# EAGLE design rapidshark-lipo-sensor-mk-2.1 (EAGLE 6.5.0)
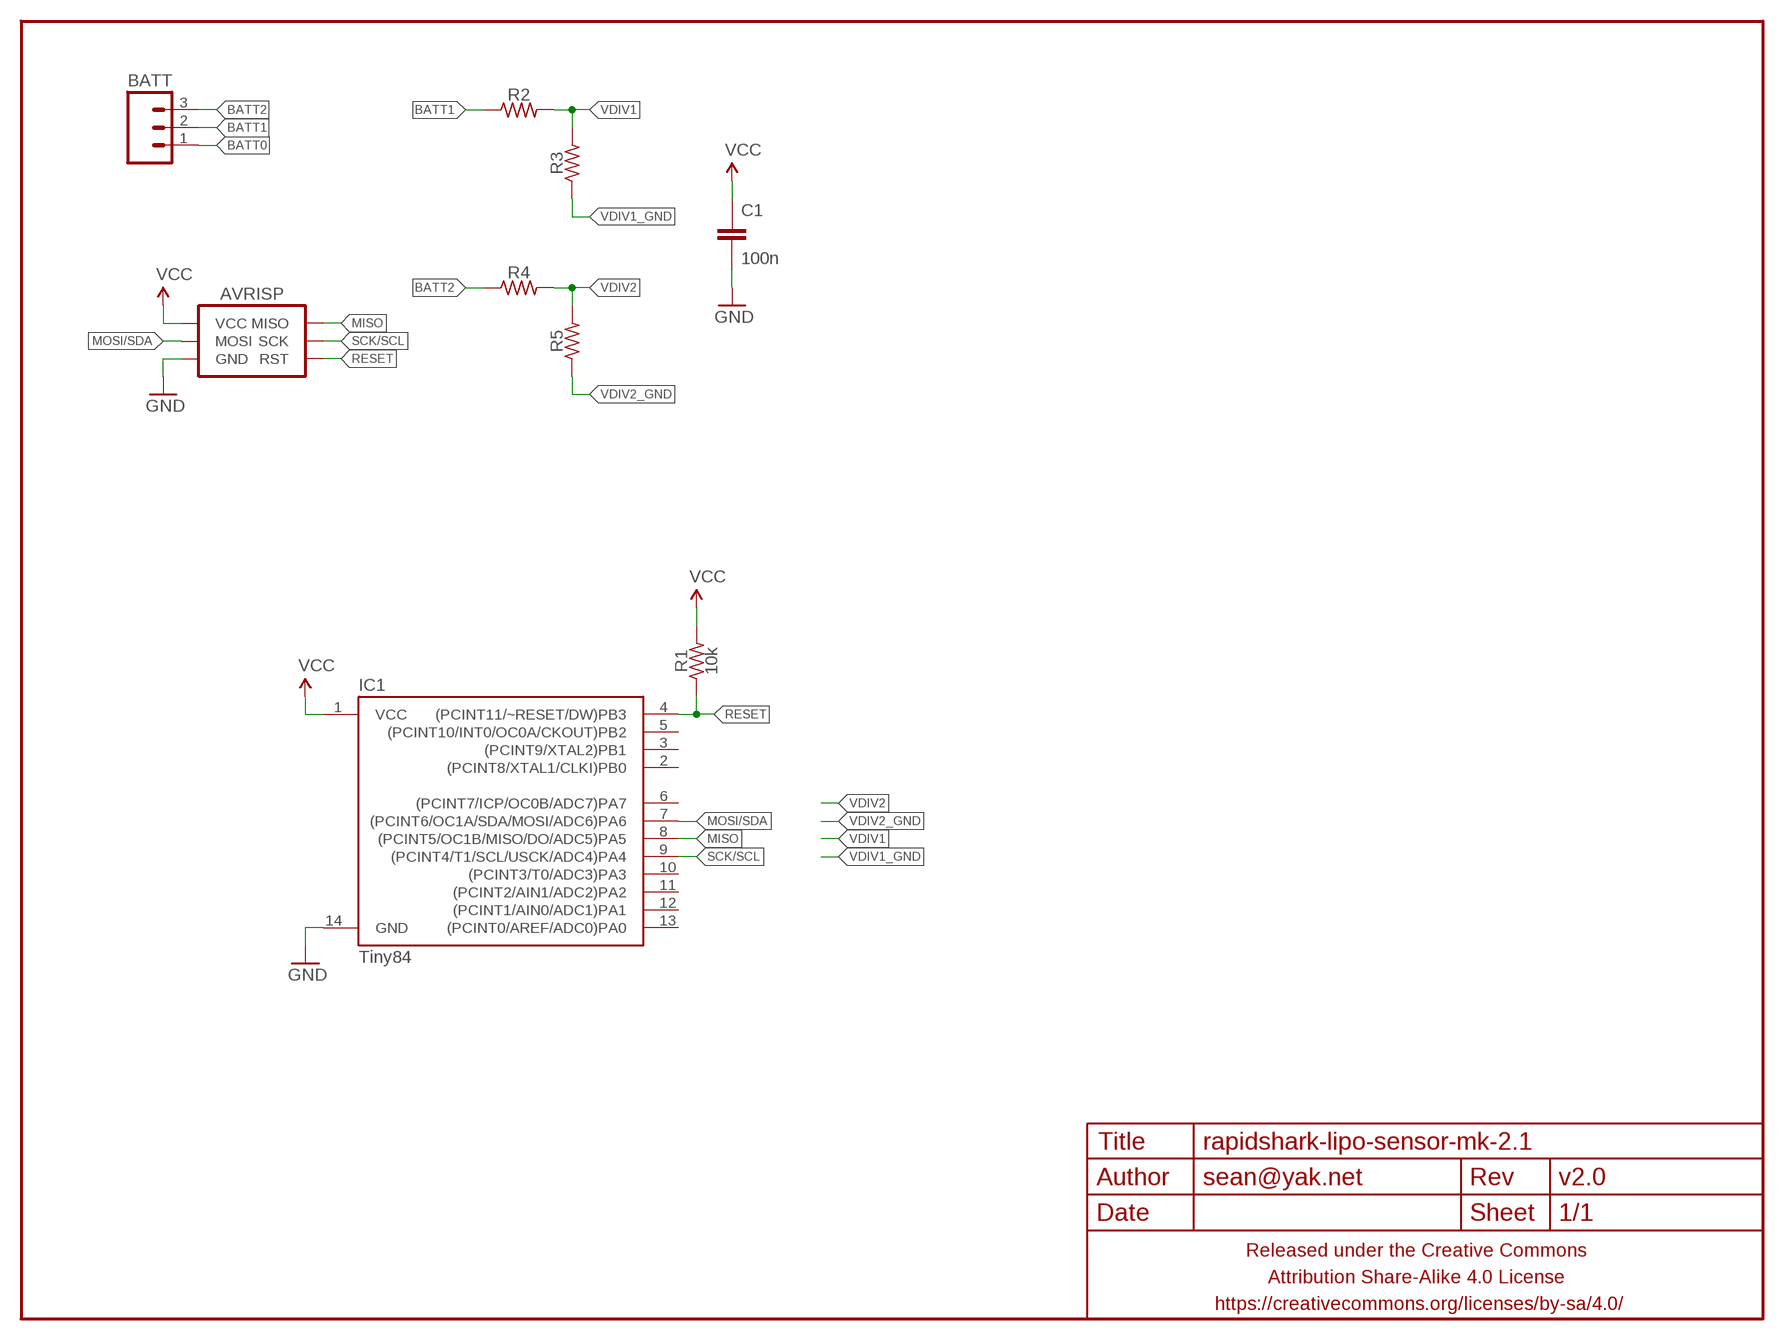
[diagram p0: schematic, sheet 1]

## Parts
AVRISP  AVR_SPI_PRG_6PTH_INLINE_I2C  [AVR_ISP_INLINE_PTH_I2C]
BATT  M03PTH-CENTERED  [1X03-CENTERED]
C1  100n  CAPACITOR-CERAMIC025-024X044  [C025-024X044]
FRAME1  FRAME-LETTERNO_PACKAGE  [DUMMY]
IC1  Tiny84  ATTINY84ATTINY84-20PU  [DIL14]
R1  10k  RESISTORPTH-AXIAL-5.08MM  [RESISTOR-AXIAL-PTH-5.08MM]
R2  RESISTORPTH-AXIAL-5.08MM  [RESISTOR-AXIAL-PTH-5.08MM]
R3  RESISTORPTH-AXIAL-5.08MM  [RESISTOR-AXIAL-PTH-5.08MM]
R4  RESISTORPTH-AXIAL-5.08MM  [RESISTOR-AXIAL-PTH-5.08MM]
R5  RESISTORPTH-AXIAL-5.08MM  [RESISTOR-AXIAL-PTH-5.08MM]

## Nets
BATT0: BATT.1
BATT1: BATT.2 R2.P$1
BATT2: BATT.3 R4.P$1
GND: AVRISP.GND C1.2 IC1.14(GND)
MISO: AVRISP.MISO IC1.8((PCINT5/OC1B/MISO/DO/ADC5)PA5)
MOSI/SDA: AVRISP.MOSI IC1.7((PCINT6/OC1A/SDA/MOSI/ADC6)PA6)
RESET: AVRISP.RESET(RST) IC1.4((PCINT11/~RESET/DW)PB3) R1.P$1
SCK/SCL: AVRISP.SCK IC1.9((PCINT4/T1/SCL/USCK/ADC4)PA4)
VCC: AVRISP.VCC C1.1 IC1.1(VCC) R1.P$2
VDIV1: R2.P$2 R3.P$2
VDIV1_GND: R3.P$1
VDIV2: R4.P$2 R5.P$2
VDIV2_GND: R5.P$1
Unconnected: IC1.2((PCINT8/XTAL1/CLKI)PB0) IC1.3((PCINT9/XTAL2)PB1) IC1.5((PCINT10/INT0/OC0A/CKOUT)PB2) IC1.6((PCINT7/ICP/OC0B/ADC7)PA7) IC1.10((PCINT3/T0/ADC3)PA3) IC1.11((PCINT2/AIN1/ADC2)PA2) IC1.12((PCINT1/AIN0/ADC1)PA1) IC1.13((PCINT0/AREF/ADC0)PA0)

## Library data of the parts
AVRISP = A_butts:AVR_SPI_PRG_6: AVR ISP 6 Pin This is the reduced ISP connector for AVR programming. Common on Arduino. This footprint will take up less PCB space and can be used with a 10-pin to 6-pin adapter such as SKU: BOB-08508 **Special note about "TEST_POINT" package. The stop mask is on the top side, so if you want your programming test points to be on the bottom of your board, make sure to place this package on the bottom side of the board. This also ensure that the orientation to program from the bottom side will be correct.
BATT = A_butts:M03: Header 3 Standard 3-pin 0.1" header. Use with straight break away headers (SKU : PRT-00116), right angle break away headers (PRT-00553), swiss pins (PRT-00743), machine pins (PRT-00117), and female headers (PRT-00115). Molex polarized connector foot print use with SKU : PRT-08232 with associated crimp pins and housings.
C1 = A_butts:CAPACITOR-CERAMIC: CAPACITOR, European symbol
FRAME1 = A_butts:FRAME-LETTER: Schematic Frame Standard 8.5x11 US Letter frame; DESIGNER: sean@yak.net; VERSION: v2.0
IC1 = A_butts:ATTINY84: Atmel 14-pin 2/4/8kB flash uC
R1-R5 = A_butts:RESISTOR: RESISTOR, American symbol

## Board
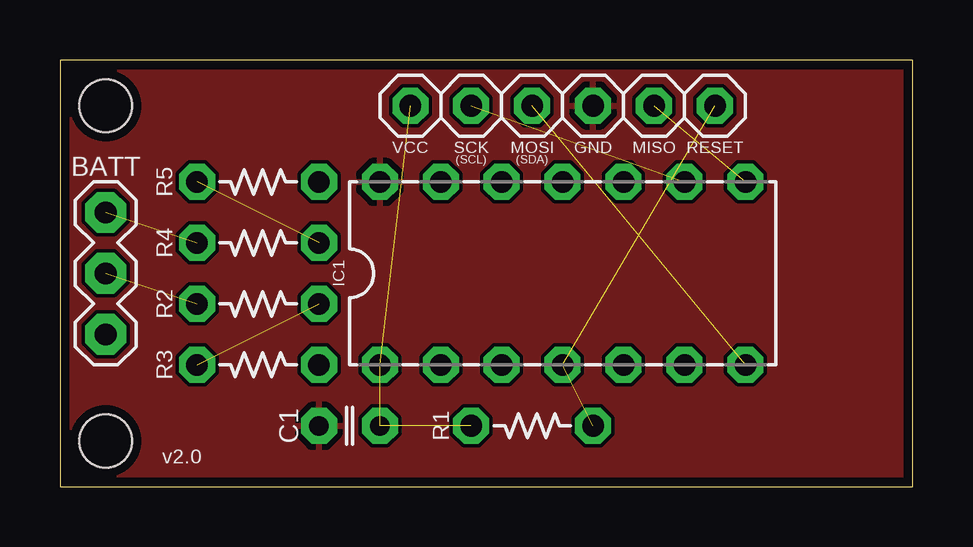
[diagram p1: board, top side]

Size 35.56 x 17.78 mm. Coordinates in mm from the lower left corner, seen from the top.
Outline: 0,17.78 0,0 35.56,0 35.56,17.78 0,17.78
Copper layers (1*16): Top 0.0356mm / dielectric 1.5011mm / Bottom 0.0356mm
Design rules "LaenPCBOrder_2": minimum track width 6mil, minimum drill 13mil, track to track 6mil, track to pad 6mil, pad to pad 6mil, via to via 6mil, smd to smd 6mil, copper to edge 15mil, drill to drill 6mil, minimum pad ring 7mil, minimum via ring 7mil, stop-mask expansion 3mil, vias tented up to drill 20mil, thermal gap 10mil
Holes 2.2 mm at 1.91,15.88 1.91,1.91

### Footprints (pad centres in the part's own frame; a part is rotated, then mirrored left to right if it is on the bottom)
AVR_ISP_INLINE_PTH_I2C = drill 0.9 pad 1.5 octagon: GND 1.27,0; MISO 3.81,0; MOSI -1.27,0; RESET 6.35,0; SCK -3.81,0; VCC -6.35,0
1X03-CENTERED = drill 0.9 pad 1.7 octagon: 1 -2.54,0; 2 0,0; 3 2.54,0
C025-024X044 = drill 0.813 pad 1.5 octagon: 1 -1.27,0; 2 1.27,0
DIL14 = drill 0.9 pad 1.5 octagon: 1 -7.62,-3.81; 2 -5.08,-3.81; 3 -2.54,-3.81; 4 0,-3.81; 5 2.54,-3.81; 6 5.08,-3.81; 7 7.62,-3.81; 8 7.62,3.81; 9 5.08,3.81; 10 2.54,3.81; 11 0,3.81; 12 -2.54,3.81; 13 -5.08,3.81; 14 -7.62,3.81
RESISTOR-AXIAL-PTH-5.08MM = drill 0.9 pad 1.5 octagon: P$1 -2.54,0; P$2 2.54,0

### Placement (x,y rotation side)
AVRISP  20.95,15.88 0 top
BATT  1.91,8.89 90 top
C1  12.06,2.54 180 top
FRAME1  0,0 0 top
IC1  20.95,8.89 0 top
R1  19.68,2.54 180 top
R2  8.26,7.62 0 top
R3  8.26,5.08 180 top
R4  8.26,10.16 0 top
R5  8.26,12.7 180 top

### Tracks (layer width: path | path; a pad name or v marks a point on that pad's centre or on a via)
BATT1  (1 unrouted)
BATT2  (1 unrouted)
GND
  pour Top: 0,17.78 35.56,17.78 35.56,0 0,0
MISO  (1 unrouted)
MOSI/SDA  (1 unrouted)
RESET  (2 unrouted)
SCK/SCL  (1 unrouted)
VCC  (3 unrouted)
VDIV1  (1 unrouted)
VDIV2  (1 unrouted)